# Altium schematic sheet Sheet1.SchDoc
size A4
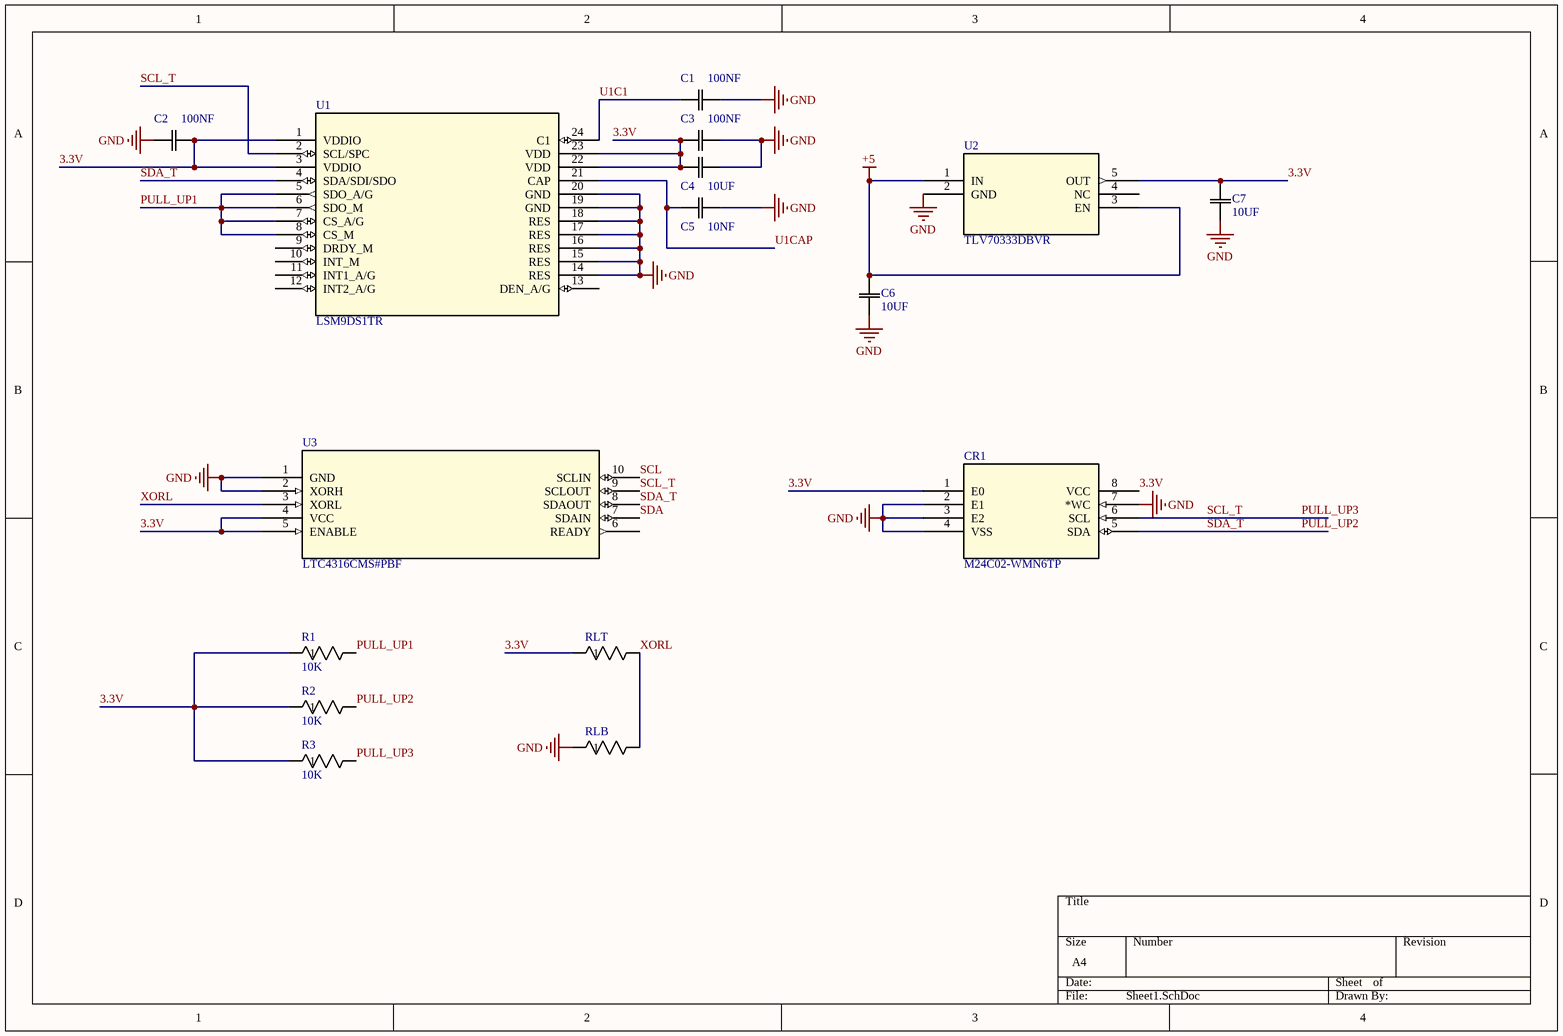
[diagram p0: Sheet1.SchDoc]

## Parts
C1  100NF  [CC0603N_YAG]
C2  100NF  [CC0603N_YAG]
C3  100NF  [CC0603N_YAG]
C4  10UF  [CC0603N_YAG]
C5  10NF  [CC0603N_YAG]
C6  10UF  [CC0603N_YAG]
C7  10UF  [CC0603N_YAG]
CR1  M24C02-WMN6TP  [SO-8_STM]
R1  10K  [0603_VIS]
R2  10K  [0603_VIS]
R3  10K  [0603_VIS]
RLB  (no value)  [0603_VIS]
RLT  (no value)  [0603_VIS]
U1  LSM9DS1TR  [LGA-24_3X3P5X1_STM]
U2  TLV70333DBVR  [DBV5_TEX]
U3  LTC4316CMS#PBF  [MSOP-10_MS_LIT]

## Nets
+5: C6.2 U2.1(IN) U2.3(EN)
GND: C1.2 C2.1 C3.2 C4.2 C5.2 C6.1 C7.1 CR1.2(E1) CR1.3(E2) CR1.4(VSS) CR1.7(*WC) RLB.1 U1.14(RES) U1.15(RES) U1.16(RES) U1.17(RES) U1.18(RES) U1.19(GND) U1.20(GND) U2.2(GND) U3.1(GND) U3.2(XORH)
3.3V: C2.2 C3.1 C4.1 C7.2 CR1.1(E0) CR1.8(VCC) R1.1 R2.1 R3.1 RLT.1 U1.1(VDDIO) U1.3(VDDIO) U1.22(VDD) U1.23(VDD) U2.5(OUT) U3.4(VCC) U3.5(ENABLE)
PULL_UP1: R1.2 U1.5(SDO_A/G) U1.6(SDO_M) U1.7(CS_A/G) U1.8(CS_M)
PULL_UP2: CR1.5(SDA) R2.2 U1.4(SDA/SDI/SDO) U3.8(SDAOUT)  [also labelled SDA_T]
PULL_UP3: CR1.6(SCL) R3.2 U1.2(SCL/SPC) U3.9(SCLOUT)  [also labelled SCL_T]
SCL: U3.10(SCLIN)
SDA: U3.7(SDAIN)
U1C1: C1.1 U1.24(C1)
U1CAP: C5.1 U1.21(CAP)
XORL: RLB.2 RLT.2 U3.3(XORL)

Not connected (* = marked no-connect by the designer): U1 9(DRDY_M) 10(INT_M) 11(INT1_A/G) 12(INT2_A/G) 13(DEN_A/G); U2 4(NC); U3 6(READY)

## Library data of the parts
C1-C7 = CC0603KRX7R9BB103: No Description Available; Vendor: Yageo; Built_By: EMA_UL_Team; SourceLibrary: Yageo_2008-01-01_ChipCaps1; Type: DEV; Manufacturer_Part_Number: CC0603KRX7R9BB103; Copyright: Copyright (C) 2018 Accelerated Designs. All rights reserved; RefDes: RefDes
CR1 = M24C02-WMN6TP: No Description Available; SourceLibrary: Update_to_database_2020-12-04; Built_By: EMA_UL_Team; Vendor: STMicroelectronics; Type: DEV; Manufacturer_Part_Number: M24C02-WMN6TP; Copyright: Copyright (C) 2018 Accelerated Designs. All rights reserved; RefDes: RefDes
R1-R3 RLB RLT = MCT0603MD1002DP500: No Description Available; Vendor: Vishay; Built_By: EMA_UL_Team; SourceLibrary: Vishay_2014-12-31; Manufacturer_Part_Number: MCT0603MD1002DP500; Copyright: Copyright (C) 2018 Accelerated Designs. All rights reserved; RefDes: RefDes; Type: DEV
U1 = LSM9DS1TR: No Description Available; Vendor: STMicroelectronics; Built_By: EMA_Jessica; SourceLibrary: Updates_to_database_2020-11-03; Manufacturer_Part_Number: LSM9DS1TR; Copyright: Copyright (C) 2018 Accelerated Designs. All rights reserved; RefDes: RefDes; Type: DEV
U2 = TLV70333DBVR: No Description Available; Vendor: Texas Instruments; Built_By: EMA_Molly; SourceLibrary: TI_2019-05-11; Manufacturer_Part_Number: TLV70333DBVR; Copyright: Copyright (C) 2018 Accelerated Designs. All rights reserved; RefDes: RefDes; Type: DEV
U3 = LTC4316CMS#PBF: No Description Available; Vendor: Linear Technology; Built_By: EMA_UL_Team; SourceLibrary: LinearTech_2016-05-13_6; Manufacturer_Part_Number: LTC4316CMS#PBF; Copyright: Copyright (C) 2018 Accelerated Designs. All rights reserved; RefDes: RefDes; Type: DEV